# EAGLE design AVRcam (EAGLE 6.1)
DATABASE: ./../../../eagle/partsdb.txt
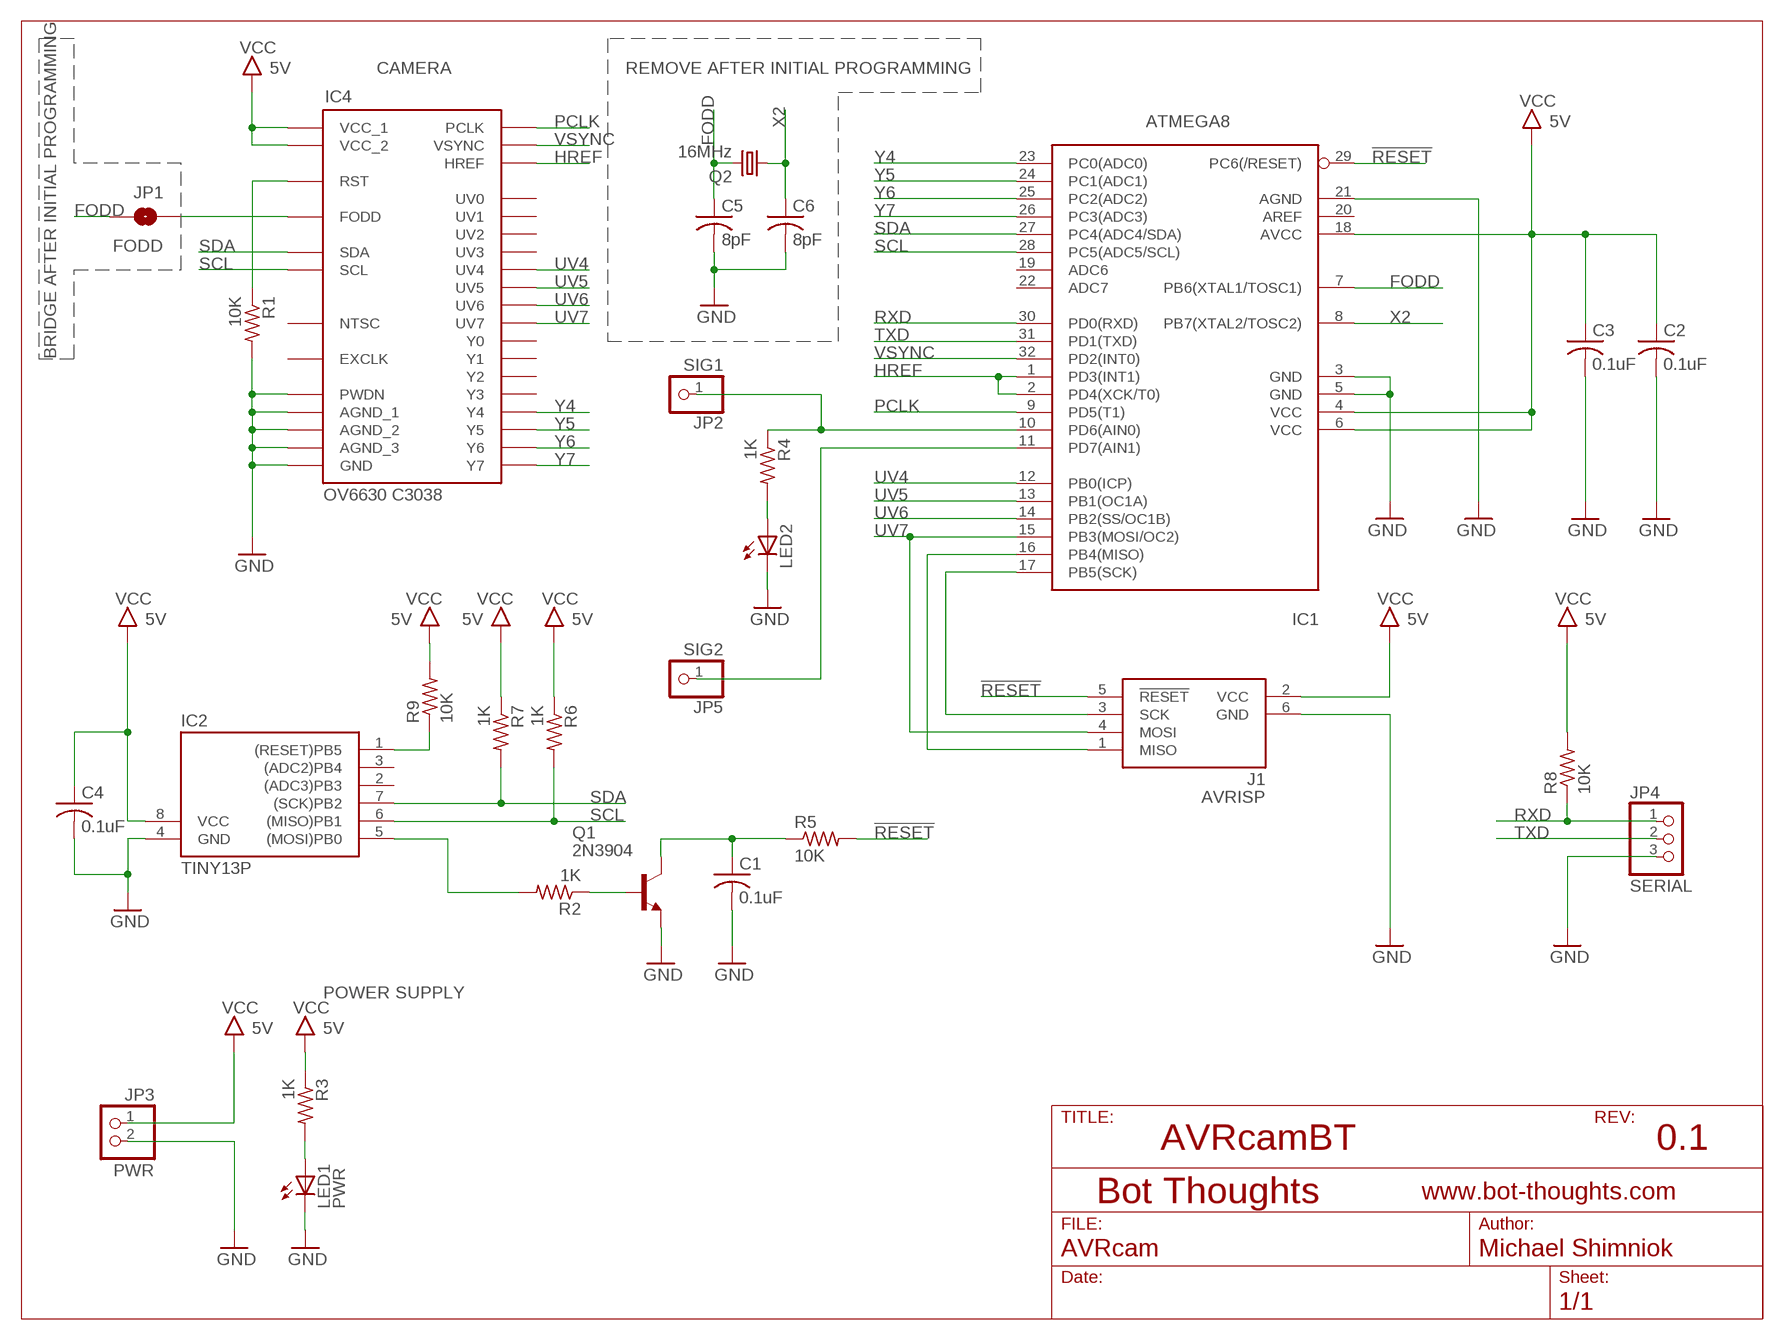
[diagram p0: schematic, sheet 1]

## Parts
C1  0.1uF  C-USC0603  [C0603]
C2  0.1uF  C-USC0603  [C0603]
C3  0.1uF  C-USC0603  [C0603]
C4  0.1uF  C-USC0603  [C0603]
C5  8pF  C-USC0603  [C0603]
C6  8pF  C-USC0603  [C0603]
IC1  ATMEGA8  MEGA8-AI  [TQFP32-08]
IC2  TINY13P  TINY12P  [DIL08]
IC4  OV6630 C3038  OV6620C3038  [C3038/C3X88/C3088]
J1  AVRISP  AVRISP6  [CON6P2R]
JP1  FODD  SOLDERJUMPERNO  [SJ_2S-NO]
JP2  SIG1  PINHD-1X01_2.54  [1X01]
JP3  PWR  PINHD-1X02_2.54-S  [1X02-S]
JP4  SERIAL  PINHD-1X03_2.54-S  [1X03-S]
JP5  SIG2  PINHD-1X01_2.54  [1X01]
LED1  PWR  LEDCHIP-LED0805  [CHIP-LED0805]
LED2  LEDCHIP-LED0805  [CHIP-LED0805]
Q1  2N3904  2N3904SMD  [SOT-23]
Q2  16MHz  CRYSTALNDK5X3  [NDK_2PAD_5X3]
R1  10K  R-US_R0603  [R0603]
R2  1K  R-US_R0603  [R0603]
R3  1K  R-US_R0603  [R0603]
R4  1K  R-US_R0603  [R0603]
R5  10K  R-US_R0603  [R0603]
R6  1K  R-US_R0603  [R0603]
R7  1K  R-US_R0603  [R0603]
R8  10K  R-US_R0603  [R0603]
R9  10K  R-US_R0603  [R0603]

## Nets
!RESET: IC1.29(PC6(/RESET)) J1.5(!RESET) R5.2
FODD: C5.1 IC1.7(PB6(XTAL1/TOSC1)) JP1.2 Q2.P$2
GND: C1.2 C2.2 C3.2 C4.2 C5.2 C6.2 IC1.3(GND) IC1.5(GND) IC1.21(AGND) IC2.4(GND) IC4.P$9(PWDN) IC4.P$15(AGND_1) IC4.P$17(AGND_2) IC4.P$21(AGND_3) IC4.P$31(GND) J1.6(GND) JP3.2 JP4.3 LED1.C LED2.C Q1.2(E) R1.2
HREF: IC1.1(PD3(INT1)) IC1.2(PD4(XCK/T0)) IC4.P$14(HREF)
MISO: IC1.16(PB4(MISO)) J1.1(MISO)
N$1: C1.1 Q1.1(C) R5.1
N$2: IC1.11(PD7(AIN1)) JP5.1
N$3: LED2.A R4.2
N$4: IC1.10(PD6(AIN0)) JP2.1 R4.1
N$6: IC1.17(PB5(SCK)) J1.3(SCK)
N$7: Q1.3(B) R2.1
N$8: LED1.A R3.2
N$13: IC4.P$10(RST) R1.1
N$27: IC4.P$12(FODD) JP1.1
N$33: IC2.5((MOSI)PB0) R2.2
N$34: IC2.1((RESET)PB5) R9.1
PCLK: IC1.9(PD5(T1)) IC4.P$18(PCLK)
RXD: IC1.30(PD0(RXD)) JP4.1 R8.1
SCL: IC1.28(PC5(ADC5/SCL)) IC2.6((MISO)PB1) IC4.P$13(SCL) R6.2
SDA: IC1.27(PC4(ADC4/SDA)) IC2.7((SCK)PB2) IC4.P$11(SDA) R7.2
TXD: IC1.31(PD1(TXD)) JP4.2
UV4: IC1.12(PB0(ICP)) IC4.P$27(UV4)
UV5: IC1.13(PB1(OC1A)) IC4.P$28(UV5)
UV6: IC1.14(PB2(SS/OC1B)) IC4.P$29(UV6)
UV7: IC1.15(PB3(MOSI/OC2)) IC4.P$30(UV7) J1.4(MOSI)
VCC: C2.1 C3.1 C4.1 IC1.4(VCC) IC1.6(VCC) IC1.18(AVCC) IC2.8(VCC) IC4.P$20(VCC_1) IC4.P$22(VCC_2) J1.2(VCC) JP3.1 R3.1 R6.1 R7.1 R8.2 R9.2 ; supply symbol labelled 5V
VSYNC: IC1.32(PD2(INT0)) IC4.P$16(VSYNC)
X2: C6.1 IC1.8(PB7(XTAL2/TOSC2)) Q2.P$1
Y4: IC1.23(PC0(ADC0)) IC4.P$5(Y4)
Y5: IC1.24(PC1(ADC1)) IC4.P$6(Y5)
Y6: IC1.25(PC2(ADC2)) IC4.P$7(Y6)
Y7: IC1.26(PC3(ADC3)) IC4.P$8(Y7)
Unconnected: IC1.19(ADC6) IC1.20(AREF) IC1.22(ADC7) IC2.2((ADC3)PB3) IC2.3((ADC2)PB4) IC4.P$1(Y0) IC4.P$2(Y1) IC4.P$3(Y2) IC4.P$4(Y3) IC4.P$19(EXCLK) IC4.P$23(UV0) IC4.P$24(UV1) IC4.P$25(UV2) IC4.P$26(UV3) IC4.P$32(NTSC)

## Notes on the sheet
- CAMERA | REMOVE AFTER INITIAL PROGRAMMING
- BRIDGE AFTER INITIAL PROGRAMMING
- POWER SUPPLY
- AVRcamBT | 0.1

## Library data of the parts
C1-C4 = rcl:C-US: CAPACITOR, American symbol; BOM: INCLUDE; PARTNO: CC0603ZRY5V9BB104
C5 C6 = rcl:C-US: CAPACITOR, American symbol; BOM: INCLUDE; PARTNO: C1608C0G1H080D
IC1 = avr-4:MEGA8: MICROCONTROLLER 8 Kbytes FLASH 1 kbytes SRAM 512 bytes EEPROM USART 6-channel 10 bit ADC 2-channel 8 bit ADC; BOM: INCLUDE; PARTNO: ATMEGA8A-AU
IC2 = avr-4:TINY12*: MICROCONTROLLER 1 Kbytes FLASH 64 bytes EEPROM; BOM: INCLUDE; PARTNO: ATTINY13V-10PU
IC4 = mes:OV6620: OV6620 Color Camera OmniVision color camera as used on AVRcam, CMUcam, etc. Pin compatible with OV6630, etc.; BOM: EXCLUDE
J1 = mes_avr:AVRISP6: 6-pin dual-row connector for Atmel AVRISP programmer interface; BOM: EXCLUDE
JP1 = SparkFun:SOLDERJUMPER: Solder Jumper Standard SMD solder jumper. Used to automate production. Two varients : Normally Open and Normally Closed are the same, but have different paste layers. NC will have a large amount of paste and should jumper during reflow.; BOM: EXCLUDE
JP2 JP5 = pinhead-2:PINHD-1X01: PIN HEADER; BOM: EXCLUDE
JP3 = pinhead-2:PINHD-1X02: PIN HEADER; BOM: EXCLUDE
JP4 = pinhead-2:PINHD-1X03: PIN HEADER; BOM: EXCLUDE
LED1 = led:LED: LED OSRAM: - CHIPLED LG R971, LG N971, LY N971, LG Q971, LY Q971, LO R971, LY R971 LH N974, LH R974 LS Q976, LO Q976, LY Q976 LO Q996 - Hyper CHIPLED LW Q18S LB Q993, LB Q99A, LB R99A - SideLED LS A670, LO A670, LY A670, LG A670, LP A670 LB A673, LV A673, LT A673, LW A673 LH A674 LY A675 LS A676, LA A676, LO A676, LY A676, LW A676 LS A679, LY A679, LG A679 - Hyper Micro SIDELED® LS Y876, LA Y876, LO Y876, LY Y876 LT Y87S - SmartLED LW L88C, LW L88S LB L89C, LB L89S, LG L890 LS L89K, LO L89K, LY L89K LS L896, LA L896, LO L896, LY L896 - TOPLED LS T670, LO T670, LY T670, LG T670, LP T670 LSG T670, LSP T670, LSY T670, LOP T670, LYG T670 LG T671, LOG T671, LSG T671 LB T673, LV T673, LT T673, LW T673 LH T674 LS T676, LA T676, LO T676, LY T676, LB T676, LH T676, LSB T676, LW T676 LB T67C, LV T67C, LT T67C, LS T67K, LO T67K, LY T67K, LW E67C LS E67B, LA E67B, LO E67B, LY E67B, LB E67C, LV E67C, LT E67C LW T67C LS T679, LY T679, LG T679 LS T770, LO T770, LY T770, LG T770, LP T770 LB T773, LV T773, LT T773, LW T773 LH T774 LS E675, LA E675, LY E675, LS T675 LS T776, LA T776, LO T776, LY T776, LB T776 LHGB T686 LT T68C, LB T68C - Hyper Mini TOPLED® LB M676 - Mini TOPLED Santana® LG M470 LS M47K, LO M47K, LY M47K Source: http://www.osram.convergy.de LUXEON: - LUMILED® LXK2-PW12-R00, LXK2-PW12-S00, LXK2-PW14-U00, LXK2-PW14-V00 LXK2-PM12-R00, LXK2-PM12-S00, LXK2-PM14-U00 LXK2-PE12-Q00, LXK2-PE12-R00, LXK2-PE12-S00, LXK2-PE14-T00, LXK2-PE14-U00 LXK2-PB12-K00, LXK2-PB12-L00, LXK2-PB12-M00, LXK2-PB14-N00, LXK2-PB14-P00, LXK2-PB14-Q00 LXK2-PR12-L00, LXK2-PR12-M00, LXK2-PR14-Q00, LXK2-PR14-R00 LXK2-PD12-Q00, LXK2-PD12-R00, LXK2-PD12-S00 LXK2-PH12-R00, LXK2-PH12-S00 LXK2-PL12-P00, LXK2-PL12-Q00, LXK2-PL12-R00 Source: www.luxeon.com KINGBRIGHT: KA-3528ASYC Source: www.kingbright.com; BOM: INCLUDE; PARTNO: APT2012EC
LED2 = led:LED: LED OSRAM: - CHIPLED LG R971, LG N971, LY N971, LG Q971, LY Q971, LO R971, LY R971 LH N974, LH R974 LS Q976, LO Q976, LY Q976 LO Q996 - Hyper CHIPLED LW Q18S LB Q993, LB Q99A, LB R99A - SideLED LS A670, LO A670, LY A670, LG A670, LP A670 LB A673, LV A673, LT A673, LW A673 LH A674 LY A675 LS A676, LA A676, LO A676, LY A676, LW A676 LS A679, LY A679, LG A679 - Hyper Micro SIDELED® LS Y876, LA Y876, LO Y876, LY Y876 LT Y87S - SmartLED LW L88C, LW L88S LB L89C, LB L89S, LG L890 LS L89K, LO L89K, LY L89K LS L896, LA L896, LO L896, LY L896 - TOPLED LS T670, LO T670, LY T670, LG T670, LP T670 LSG T670, LSP T670, LSY T670, LOP T670, LYG T670 LG T671, LOG T671, LSG T671 LB T673, LV T673, LT T673, LW T673 LH T674 LS T676, LA T676, LO T676, LY T676, LB T676, LH T676, LSB T676, LW T676 LB T67C, LV T67C, LT T67C, LS T67K, LO T67K, LY T67K, LW E67C LS E67B, LA E67B, LO E67B, LY E67B, LB E67C, LV E67C, LT E67C LW T67C LS T679, LY T679, LG T679 LS T770, LO T770, LY T770, LG T770, LP T770 LB T773, LV T773, LT T773, LW T773 LH T774 LS E675, LA E675, LY E675, LS T675 LS T776, LA T776, LO T776, LY T776, LB T776 LHGB T686 LT T68C, LB T68C - Hyper Mini TOPLED® LB M676 - Mini TOPLED Santana® LG M470 LS M47K, LO M47K, LY M47K Source: http://www.osram.convergy.de LUXEON: - LUMILED® LXK2-PW12-R00, LXK2-PW12-S00, LXK2-PW14-U00, LXK2-PW14-V00 LXK2-PM12-R00, LXK2-PM12-S00, LXK2-PM14-U00 LXK2-PE12-Q00, LXK2-PE12-R00, LXK2-PE12-S00, LXK2-PE14-T00, LXK2-PE14-U00 LXK2-PB12-K00, LXK2-PB12-L00, LXK2-PB12-M00, LXK2-PB14-N00, LXK2-PB14-P00, LXK2-PB14-Q00 LXK2-PR12-L00, LXK2-PR12-M00, LXK2-PR14-Q00, LXK2-PR14-R00 LXK2-PD12-Q00, LXK2-PD12-R00, LXK2-PD12-S00 LXK2-PH12-R00, LXK2-PH12-S00 LXK2-PL12-P00, LXK2-PL12-Q00, LXK2-PL12-R00 Source: www.luxeon.com KINGBRIGHT: KA-3528ASYC Source: www.kingbright.com; PARTNO: APT2012SGC
Q1 = mes_transistors:2N3904: NPN Transistor Small signal NPN Bipolar Junction Transistor (BJT). Use this device to represent any of a number of such transistors with similar package and pinout: 2N4401, 2N3904, 2N2222, etc.; BOM: INCLUDE; PARTNO: MMBT3904-7-F
Q2 = mes_crystal:CRYSTAL: CRYSTAL; BOM: INCLUDE; PARTNO: NX5032GA-16.000000MHZ-LN-CD-1
R1 R5 R8 R9 = rcl:R-US_: RESISTOR, American symbol; BOM: INCLUDE; PARTNO: ERJ-3GEYJ103V
R2-R4 R6 R7 = rcl:R-US_: RESISTOR, American symbol; BOM: INCLUDE; PARTNO: ERJ-3GEYJ102V

## Board
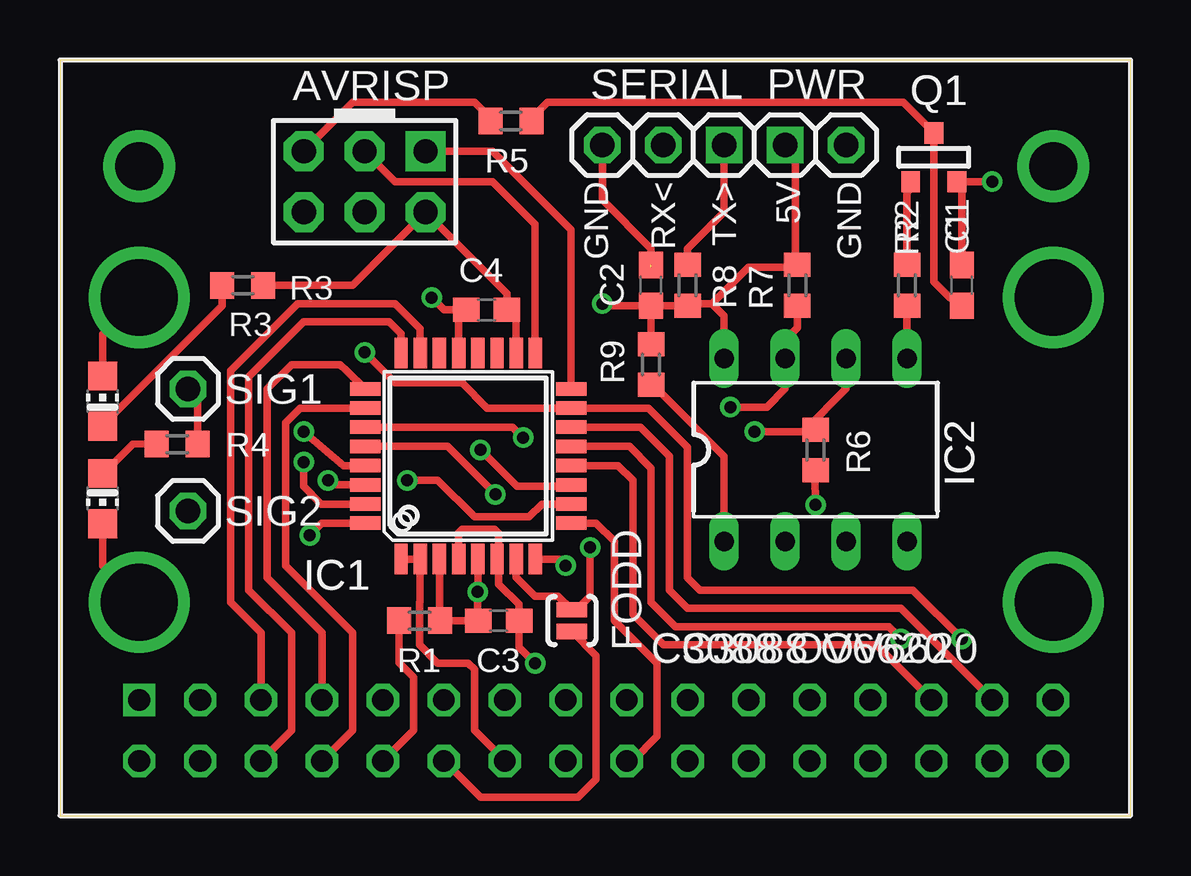
[diagram p1: board, top side]
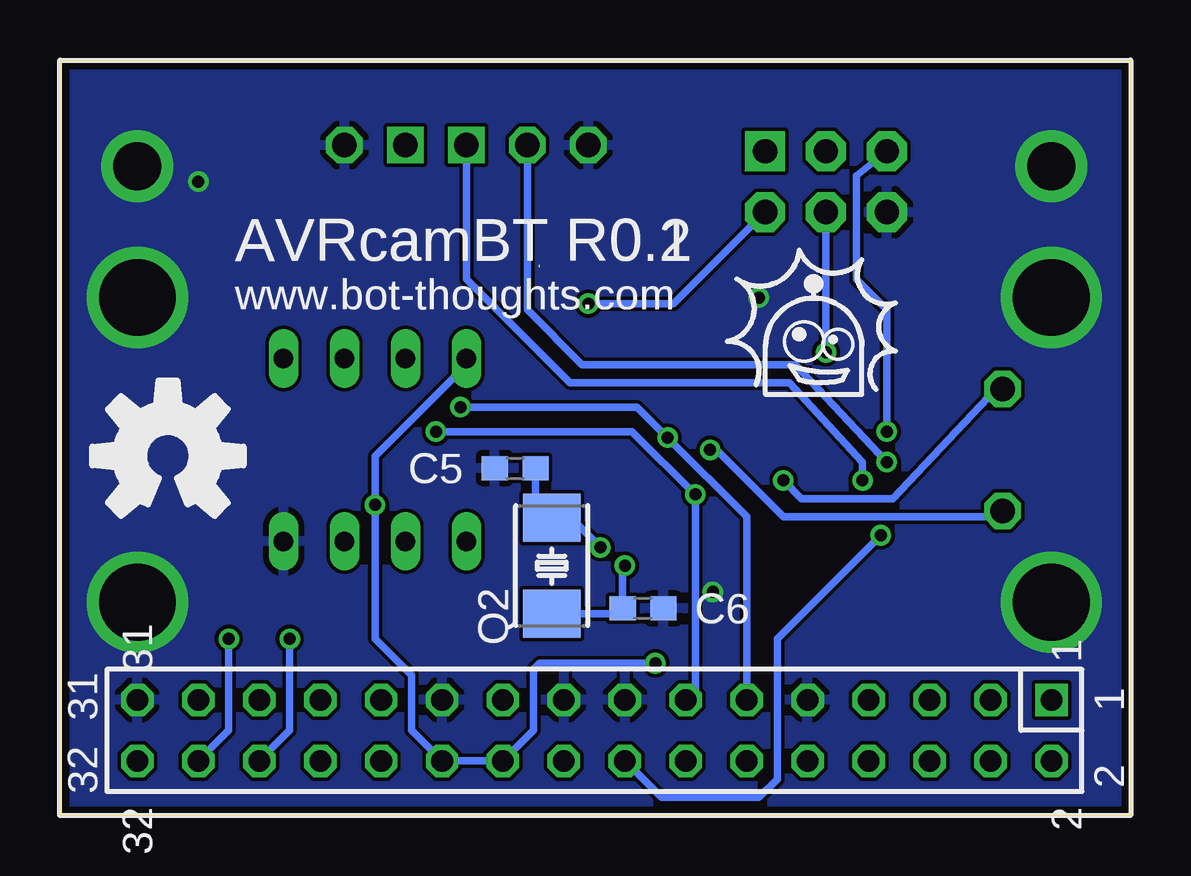
[diagram p2: board, bottom side, seen from below]

Size 44.63 x 31.49 mm. Coordinates in mm from the lower left corner, seen from the top.
Outline: 0,0 44.63,0 44.63,31.49 0,31.49 0,0
Copper layers (1*16): Top 0.0356mm / dielectric 1.5011mm / Bottom 0.0356mm
Design rules "default": minimum track width 6mil, minimum drill 13mil, track to track 6mil, track to pad 6mil, pad to pad 6mil, via to via 6mil, smd to smd 6mil, copper to edge 15mil, drill to drill 6mil, minimum pad ring 7mil, minimum via ring 7mil, stop-mask expansion 4mil, vias tented up to drill 20mil, thermal gap 10mil

### Footprints (pad centres in the part's own frame; a part is rotated, then mirrored left to right if it is on the bottom)
C0603 = smd 1.1 x 1: 1 -0.85,0; 2 0.85,0
TQFP32-08 = smd 1.27 x 0.559: 1 -4.293,2.8; 2 -4.293,2; 3 -4.293,1.2; 4 -4.293,0.4; 5 -4.293,-0.4; 6 -4.293,-1.2; 7 -4.293,-2; 8 -4.293,-2.8; 17 4.293,-2.8; 18 4.293,-2; 19 4.293,-1.2; 20 4.293,-0.4; 21 4.293,0.4; 22 4.293,1.2; 23 4.293,2; 24 4.293,2.8 | smd 0.559 x 1.27: 9 -2.8,-4.293; 10 -2,-4.293; 11 -1.2,-4.293; 12 -0.4,-4.293; 13 0.4,-4.293; 14 1.2,-4.293; 15 2,-4.293; 16 2.8,-4.293; 25 2.8,4.293; 26 2,4.293; 27 1.2,4.293; 28 0.4,4.293; 29 -0.4,4.293; 30 -1.2,4.293; 31 -2,4.293; 32 -2.8,4.293
DIL08 = drill 0.813 long: 1 -3.81,-3.81; 2 -1.27,-3.81; 3 1.27,-3.81; 4 3.81,-3.81; 5 3.81,3.81; 6 1.27,3.81; 7 -1.27,3.81; 8 -3.81,3.81
C3038/C3X88/C3088 = drill 0.9 square: P$1 -1.27,19.05 | drill 0.9 octagon: P$2 1.27,19.05; P$3 -1.27,16.51; P$4 1.27,16.51; P$5 -1.27,13.97; P$6 1.27,13.97; P$7 -1.27,11.43; P$8 1.27,11.43; P$9 -1.27,8.89; P$10 1.27,8.89; P$11 -1.27,6.35; P$12 1.27,6.35; P$13 -1.27,3.81; P$14 1.27,3.81; P$15 -1.27,1.27; P$16 1.27,1.27; P$17 -1.27,-1.27; P$18 1.27,-1.27; P$19 -1.27,-3.81; P$20 1.27,-3.81; P$21 -1.27,-6.35; P$22 1.27,-6.35; P$23 -1.27,-8.89; P$24 1.27,-8.89; P$25 -1.27,-11.43; P$26 1.27,-11.43; P$27 -1.27,-13.97; P$28 1.27,-13.97; P$29 -1.27,-16.51; P$30 1.27,-16.51; P$31 -1.27,-19.05; P$32 1.27,-19.05
CON6P2R = drill 1.016 pad 1.676 square: 1 -2.54,-1.27 | drill 1.016 pad 1.676 octagon: 2 -2.54,1.27; 3 0,-1.27; 4 0,1.27; 5 2.54,-1.27; 6 2.54,1.27
SJ_2S-NO = smd 0.635 x 1.27: 1 -0.45,0; 2 0.45,0
1X01 = drill 1.016 octagon: 1 0,0
1X02-S = drill 1.016 square: 1 -1.27,0 | drill 1.016 octagon: 2 1.27,0
1X03-S = drill 1.016 square: 1 -2.54,0 | drill 1.016 octagon: 2 0,0; 3 2.54,0
CHIP-LED0805 = smd 1.2 x 1.2: A 0,-1.05; C 0,1.05
SOT-23 = smd 0.787 x 0.889: 1 0.025,-1.016; 2 -0.94,1.016; 3 0.991,1.016
NDK_2PAD_5X3 = smd 2 x 2.4: P$1 -2,0; P$2 2,0
R0603 = smd 1 x 1.1: 1 -0.85,0; 2 0.85,0

### Placement (x,y rotation side)
C1  37.59,22.1 90 top
C2  24.64,22.1 90 top
C3  18.29,8.13 180 top
C4  17.78,21.08 180 top
C5  25.65,14.48 180 bottom
C6  20.32,8.64 0 bottom
IC1  17.02,14.99 90 top
IC2  31.5,15.24 0 top
IC4  22.35,3.56 270 bottom
J1  12.7,26.42 180 top
JP1  21.34,8.13 90 top
JP2  5.33,17.78 0 top
JP3  31.5,27.94 0 top
JP4  25.15,27.94 180 top
JP5  5.33,12.7 0 top
LED1  1.78,17.27 0 top
LED2  1.78,13.21 180 top
Q1  36.45,27.43 180 top
Q2  24.13,10.41 90 bottom
R1  14.99,8.13 0 top
R2  35.31,22.1 270 top
R3  7.62,22.1 180 top
R4  4.89,15.48 180 top
R5  18.8,28.94 180 top
R6  31.5,15.24 90 top
R7  30.73,22.1 270 top
R8  26.16,22.1 270 top
R9  24.64,18.8 90 top

### Tracks (layer width: path | path; a pad name or v marks a point on that pad's centre or on a via)
!RESET  (via drill 0.5)
  Top 0.305: IC1.29 11.83,14.59 v10.16,16 | R5.2 17.95,29.04 17.27,29.72 12.19,29.72 J1.5
  Bottom 0.305: v10.16,16 10.16,21.08 11.43,22.35 11.43,26.67 J1.5
FODD  (via drill 0.5)
  Top 0.305: IC1.7 19.02,9.94 19.81,9.14 20.77,9.14 JP1.2 21.53,8.58 22.1,9.14 v22.1,11.18
  Bottom 0.305: C5.1 24.8,13.37 23.88,12.45 Q2.P$2 23.37,12.45 v22.1,11.18
GND  (via drill 0.5, 2, 3.2)  (1 unrouted)
  Top 0.305: R1.2 15.84,8.04 | IC1.3 15.82,8.15 R1.2 | 15.75,8.13 R1.2 | 17.42,8.15 C3.2 | R1.2 C3.2 | C3.2 17.53,8.13 | C1.2 37.59,26.09 Q1.2 v38.86,26.42 | IC1.21 16.62,20.68 17.02,21.08 C4.2 16,21.08 v15.49,21.59 | IC1.5 17.42,9.4 | 17.42,9.4 v17.42,9.31 17.41,9.31 | 17.42,9.4 17.41,9.39 v17.41,9.32 17.41,8.15 C3.2 | JP4.3 22.61,25.65 24.64,23.62 24.64,22.86 | LED1.C 1.78,20.07 v3.3,21.59 | LED2.C 1.78,10.41 v3.3,8.89
  other vias: 41.4,8.89 41.4,21.59 3.3,27.05 41.4,27.05
  pour Bottom: -0.25,31.5 44.96,31.5 44.96,0 -0.25,0.25
HREF
  Top 0.305: IC1.1 IC1.2 15.02,8.92 14.99,8.89 14.99,7.11 15.75,6.35 17.02,6.35 17.27,6.1 17.27,3.56 IC4.P$14
MISO
  Top 0.305: IC1.16 21.31,24.41 18.03,27.69 J1.1
N$1
  Top 0.305: C1.1 37.5,21.59 37.08,21.59 36.42,22.25 Q1.1 35.15,29.72 20.32,29.72 19.65,29.04 R5.1
N$2  (via drill 0.5)
  Top 0.305: v17.53,15.24 19.05,13.72 21.08,13.72 IC1.11
  Bottom 0.305: v17.53,15.24 17.27,15.24 14.48,12.45 5.59,12.45 JP5.1
N$3
  Top 0.305: R4.2 4.06,15.49 3.04,15.48 1.78,14.22 LED2.A
N$4  (via drill 0.5)
  Top 0.305: IC1.10 20.1,12.99 19.56,12.45 17.27,12.45 15.75,13.97 v14.48,13.97 | R4.1 5.74,17.38 JP2.1
  Bottom 0.305: JP2.1 5.59,17.78 9.91,13.21 13.72,13.21 v14.48,13.97
N$6
  Top 0.305: J1.3 13.97,26.42 18.03,26.42 19.81,24.64 19.81,19.3 19.82,19.3 IC1.17
N$7
  Top 0.305: R2.1 35.31,25.88 Q1.3
N$8
  Top 0.305: LED1.A 2,16.48 6.77,21.25 R3.2
N$13
  Top 0.305: 14.22,8.13 R1.1 13.97,8.13 14.13,7.96 14.13,6.36 14.73,5.77 14.73,3.56 IC4.P$10
N$27
  Top 0.305: IC4.P$12 17.53,0.76 21.59,0.76 22.35,1.52 22.35,6.66 JP1.1
N$33
  Top 0.305: IC2.5 R2.2
N$34
  Top 0.305: R9.1 25.15,17.53 27.69,14.99 IC2.1
PCLK
  Top 0.305: IC4.P$18 23.88,2.29 24.89,3.3 24.89,6.35 23.11,8.13 23.11,11.43 22.35,12.19 IC1.9
RXD  (via drill 0.5)
  Top 0.305: IC1.30 11.36,13.79 v11.18,13.97 | R8.1 26.16,23.62 27.69,25.15 JP4.1
  Bottom 0.305: v11.18,13.97 11.18,14.73 14.22,18.03 23.37,18.03 27.69,22.35 JP4.1
SCL  (via drill 0.5)
  Top 0.305: 32.77,19.81 IC2.6 32.77,17.78 31.08,16.09 | v28.96,16 30.99,16 31.08,16.09 | IC1.28 16.15,15.39 v18.15,13.39 | R6.2 31.08,16.09
  Bottom 0.305: v28.96,16 20.78,16 18.15,13.37 | 18.15,13.37 18.15,5.22 IC4.P$13 | 18.15,13.37 v18.15,13.39
SDA  (via drill 0.5)
  Top 0.305: R7.2 30.73,20.32 30.23,19.81 IC2.7 30.23,17.78 29.46,17.02 v27.94,17.02 | IC1.27 18.87,16.19 v19.3,15.75
  Bottom 0.305: IC4.P$11 16,12.45 v19.3,15.75 20.57,17.02 v27.94,17.02
TXD  (via drill 0.5)
  Top 0.305: IC1.31 10.89,12.99 10.16,13.72 v10.16,14.73
  Bottom 0.305: JP4.2 25.15,21.08 22.86,18.8 13.97,18.8 v10.16,14.73
UV4
  Top 0.305: IC4.P$27 34.04,7.11 25.15,7.11 23.88,8.38 23.88,13.97 23.26,14.59 IC1.12
UV5  (via drill 0.5)
  Top 0.305: v35.05,7.37 34.54,7.87 25.65,7.87 24.64,8.89 24.64,14.48 23.73,15.39 IC1.13
  Bottom 0.305: v35.05,7.37 35.05,3.56 IC4.P$28
UV6
  Top 0.305: IC4.P$29 35.05,8.64 26.16,8.64 25.4,9.4 25.4,14.99 24.2,16.19 IC1.14
UV7  (via drill 0.5)
  Top 0.305: v37.59,7.37 35.56,9.4 26.67,9.4 26.16,9.91 26.16,15.35 24.54,16.98 IC1.15 17.81,16.99 16.76,18.03 13.97,18.03 v12.7,19.3
  Bottom 0.305: v37.59,7.37 37.59,3.56 IC4.P$30 | v12.7,19.3 J1.4
VCC  (via drill 0.5)
  Top 0.305: 18.97,20.92 C4.1 | C4.1 19.02,20.69 IC1.18 | C4.1 18.63,21.76 J1.2 12.19,22.1 R3.1 | IC1.4 16.62,11.79 16.76,11.94 18.11,11.94 18.29,11.76 18.29,10.76 IC1.6 18.29,10.62 18.29,9.65 19.14,8.8 C3.1 19.14,7.02 v19.81,6.35 | C2.1 22.69,21.25 v22.61,21.34 | R9.2 C2.1 | C2.1 R8.2 26.25,21.34 27.18,21.34 | C2.1 24.64,21.34 | 27.18,21.34 28.7,22.86 30.65,22.86 R7.1 30.65,22.95 30.65,27.52 JP3.1 | IC2.8 27.69,20.83 27.18,21.34 | R6.1 31.47,14.21 v31.5,12.95
  Bottom 0.305: v22.61,21.34 19.05,21.34 J1.2 | v19.81,6.35 24.64,6.35 24.89,6.1 24.89,3.56 IC4.P$20 IC4.P$22 29.97,3.56 29.97,5.84 31.5,7.37 v31.5,12.95 31.5,14.99 27.69,18.8 IC2.8
VSYNC  (via drill 0.5)
  Top 0.305: IC1.32 10.9,12.19 v10.41,11.68
  Bottom 0.305: IC4.P$16 19.56,0.76 15.49,0.76 14.73,1.52 14.73,7.37 v10.41,11.68
X2  (via drill 0.5)
  Top 0.305: IC1.8 20.8,10.69 v21.08,10.41
  Bottom 0.305: 21.11,10.45 v21.08,10.41 21.17,10.33 C6.1 21.39,8.41 Q2.P$1
Y4
  Top 0.305: IC4.P$5 8.38,7.62 7.11,8.89 7.11,18.54 9.91,21.34 13.97,21.34 15.02,20.29 IC1.23
Y5
  Top 0.305: IC4.P$6 9.65,3.56 9.65,7.62 7.87,9.4 7.87,18.29 10.16,20.57 13.72,20.57 14.22,20.07 IC1.24
Y6
  Top 0.305: IC4.P$7 10.92,7.62 8.64,9.91 8.64,17.78 9.65,18.8 11.68,18.8 11.94,18.54 12.72,17.78 IC1.25
Y7
  Top 0.305: IC4.P$8 12.19,3.56 12.19,7.62 9.4,10.41 9.4,16.37 10.01,16.98 12.72,16.98 IC1.26

### Text on the board
tNames: GND | RX< | TX> | 5V | GND | C3088 OV6620
bNames: AVRcamBT R0.1 | www.bot-thoughts.com
_tsilk: AVRISP | SERIAL | PWR | Q1 | R5 | GND | RX< | TX> | 5V | GND | R2 | C1 | R8 | C4 | C2 | R7 | R3 | R9 | SIG1 | IC2 | R6 | R4 | SIG2 | FODD | IC1 | R1 | C3 | C3088 OV6620
_bsilk: AVRcamBT R0.2 | www.bot-thoughts.com | C5 | C6 | Q2 | 31 | 1 | 32 | 2